# EAGLE design Mainboard (EAGLE 8.4.3)

## Sheet 1 of 3
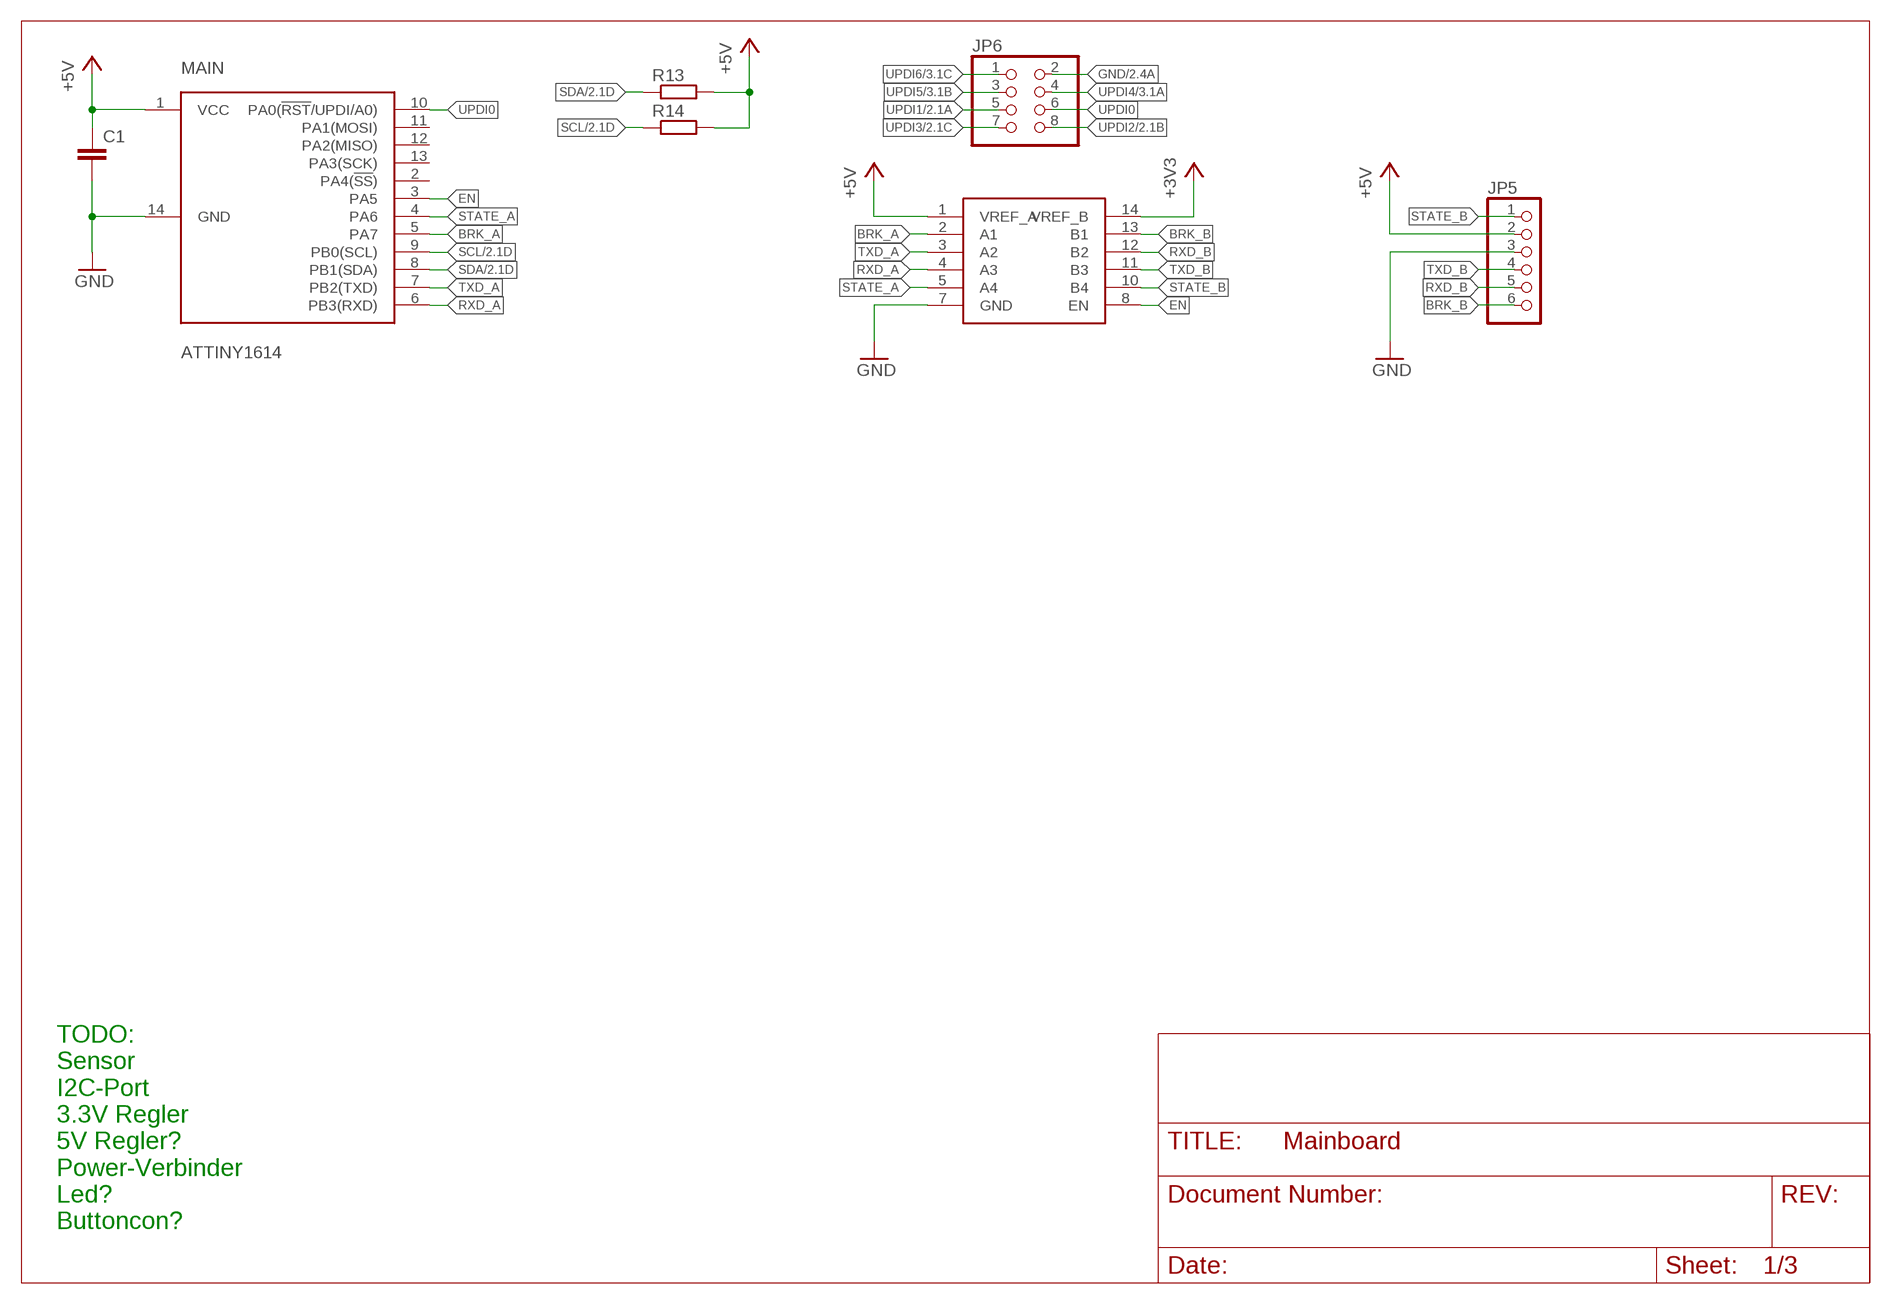
[diagram p0: schematic, sheet 1]

### Parts
C1  C-EUC0805  [C0805]
JP5  PINHD-1X6  [1X06]
JP6  PINHD-2X4  [2X04]
MAIN  ATTINY1614  ATTINY1614/16/17SSNR/SSFR  [SOIC14]
R13  R-EU_R0805  [R0805]
R14  R-EU_R0805  [R0805]
U$2  LSF0204  [TSSOP14]

### Nets
+3V3: U$2.14(VREF_B)
+5V: C1.1 JP5.2 MAIN.1(VCC) R13.2 R14.2 U$2.1(VREF_A) ; also sheet 2,3
BRK_A: MAIN.5(PA7) U$2.2(A1)
BRK_B: JP5.6 U$2.13(B1)
EN: MAIN.3(PA5) U$2.8(EN)
GND: C1.2 JP5.3 JP6.2 MAIN.14(GND) U$2.7(GND) ; also sheet 2,3
RXD_A: MAIN.6(PB3(RXD)) U$2.4(A3)
RXD_B: JP5.5 U$2.12(B2)
SCL: MAIN.9(PB0(SCL)) R14.1 ; also sheet 2,3
SDA: MAIN.8(PB1(SDA)) R13.1 ; also sheet 2,3
STATE_A: MAIN.4(PA6) U$2.5(A4)
STATE_B: JP5.1 U$2.10(B4)
TXD_A: MAIN.7(PB2(TXD)) U$2.3(A2)
TXD_B: JP5.4 U$2.11(B3)
UPDI0: JP6.6 MAIN.10(PA0(!RST!/UPDI/A0))
UPDI1: JP6.5 ; also sheet 2
UPDI2: JP6.8 ; also sheet 2
UPDI3: JP6.7 ; also sheet 2
UPDI4: JP6.4 ; also sheet 3
UPDI5: JP6.3 ; also sheet 3
UPDI6: JP6.1 ; also sheet 3
Unconnected: MAIN.2(PA4(!SS!)) MAIN.11(PA1(MOSI)) MAIN.12(PA2(MISO)) MAIN.13(PA3(SCK))

### Notes on the sheet
- TODO:
  Sensor
  I2C-Port
  3.3V Regler
  5V Regler?
  Power-Verbinder
  Led?
  Buttoncon?

## Sheet 2 of 3
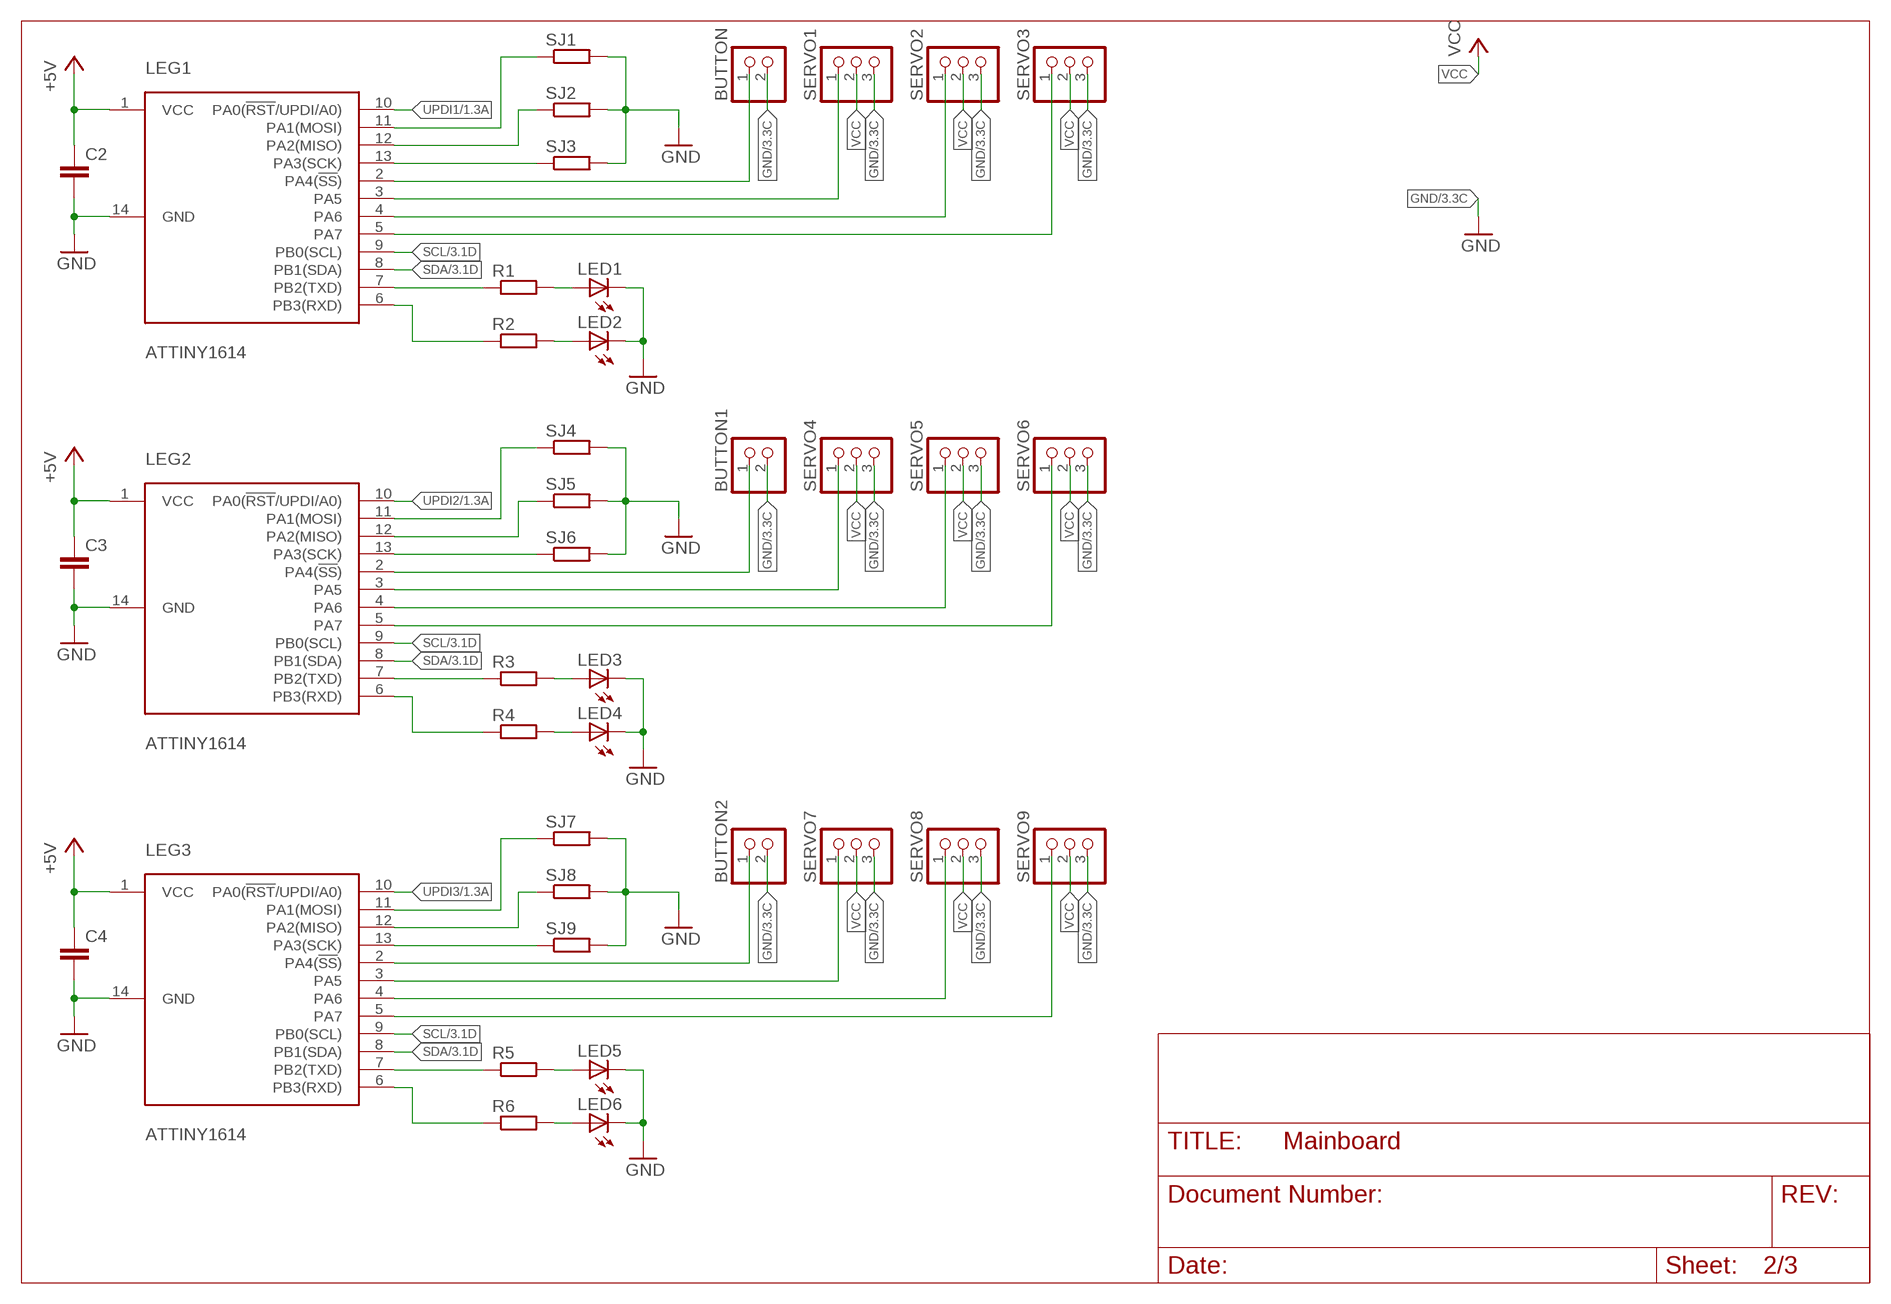
[diagram p1: schematic, sheet 2]

### Parts
BUTTON  PINHD-1X2  [1X02]
BUTTON1  PINHD-1X2  [1X02]
BUTTON2  PINHD-1X2  [1X02]
C2  C-EUC0805  [C0805]
C3  C-EUC0805  [C0805]
C4  C-EUC0805  [C0805]
LED1  LEDCHIP-LED0805  [CHIP-LED0805]
LED2  LEDCHIP-LED0805  [CHIP-LED0805]
LED3  LEDCHIP-LED0805  [CHIP-LED0805]
LED4  LEDCHIP-LED0805  [CHIP-LED0805]
LED5  LEDCHIP-LED0805  [CHIP-LED0805]
LED6  LEDCHIP-LED0805  [CHIP-LED0805]
LEG1  ATTINY1614  ATTINY1614/16/17SSNR/SSFR  [SOIC14]
LEG2  ATTINY1614  ATTINY1614/16/17SSNR/SSFR  [SOIC14]
LEG3  ATTINY1614  ATTINY1614/16/17SSNR/SSFR  [SOIC14]
R1  R-EU_R0805  [R0805]
R2  R-EU_R0805  [R0805]
R3  R-EU_R0805  [R0805]
R4  R-EU_R0805  [R0805]
R5  R-EU_R0805  [R0805]
R6  R-EU_R0805  [R0805]
SERVO1  PINHD-1X3  [1X03]
SERVO2  PINHD-1X3  [1X03]
SERVO3  PINHD-1X3  [1X03]
SERVO4  PINHD-1X3  [1X03]
SERVO5  PINHD-1X3  [1X03]
SERVO6  PINHD-1X3  [1X03]
SERVO7  PINHD-1X3  [1X03]
SERVO8  PINHD-1X3  [1X03]
SERVO9  PINHD-1X3  [1X03]
SJ1  R-EU_R0402  [R0402]
SJ2  R-EU_R0402  [R0402]
SJ3  R-EU_R0402  [R0402]
SJ4  R-EU_R0402  [R0402]
SJ5  R-EU_R0402  [R0402]
SJ6  R-EU_R0402  [R0402]
SJ7  R-EU_R0402  [R0402]
SJ8  R-EU_R0402  [R0402]
SJ9  R-EU_R0402  [R0402]

### Nets
+5V: C2.1 C3.1 C4.1 LEG1.1(VCC) LEG2.1(VCC) LEG3.1(VCC) ; also sheet 1,3
GND: BUTTON1.2 BUTTON2.2 BUTTON.2 C2.2 C3.2 C4.2 LED1.C LED2.C LED3.C LED4.C LED5.C LED6.C LEG1.14(GND) LEG2.14(GND) LEG3.14(GND) SERVO1.3 SERVO2.3 SERVO3.3 SERVO4.3 SERVO5.3 SERVO6.3 SERVO7.3 SERVO8.3 SERVO9.3 SJ1.2 SJ2.2 SJ3.2 SJ4.2 SJ5.2 SJ6.2 SJ7.2 SJ8.2 SJ9.2 ; also sheet 1,3
N$1: LEG1.7(PB2(TXD)) R1.1
N$2: LEG1.6(PB3(RXD)) R2.1
N$3: LEG1.11(PA1(MOSI)) SJ1.1
N$4: LEG1.12(PA2(MISO)) SJ2.1
N$5: LEG1.13(PA3(SCK)) SJ3.1
N$6: LED1.A R1.2
N$7: LED2.A R2.2
N$8: BUTTON.1 LEG1.2(PA4(!SS!))
N$9: LEG1.3(PA5) SERVO1.1
N$10: LEG1.4(PA6) SERVO2.1
N$11: LED3.A R3.2
N$12: LEG1.5(PA7) SERVO3.1
N$13: LED4.A R4.2
N$14: LEG2.7(PB2(TXD)) R3.1
N$15: LEG2.6(PB3(RXD)) R4.1
N$22: LEG2.11(PA1(MOSI)) SJ4.1
N$23: LEG2.12(PA2(MISO)) SJ5.1
N$24: LEG2.13(PA3(SCK)) SJ6.1
N$25: BUTTON1.1 LEG2.2(PA4(!SS!))
N$26: LEG2.3(PA5) SERVO4.1
N$27: LEG2.4(PA6) SERVO5.1
N$28: LEG2.5(PA7) SERVO6.1
N$29: LED5.A R5.2
N$30: LED6.A R6.2
N$31: LEG3.7(PB2(TXD)) R5.1
N$32: LEG3.6(PB3(RXD)) R6.1
N$33: LEG3.11(PA1(MOSI)) SJ7.1
N$34: LEG3.12(PA2(MISO)) SJ8.1
N$35: LEG3.13(PA3(SCK)) SJ9.1
N$36: BUTTON2.1 LEG3.2(PA4(!SS!))
N$37: LEG3.3(PA5) SERVO7.1
N$38: LEG3.4(PA6) SERVO8.1
N$39: LEG3.5(PA7) SERVO9.1
SCL: LEG1.9(PB0(SCL)) LEG2.9(PB0(SCL)) LEG3.9(PB0(SCL)) ; also sheet 1,3
SDA: LEG1.8(PB1(SDA)) LEG2.8(PB1(SDA)) LEG3.8(PB1(SDA)) ; also sheet 1,3
UPDI1: LEG1.10(PA0(!RST!/UPDI/A0)) ; also sheet 1
UPDI2: LEG2.10(PA0(!RST!/UPDI/A0)) ; also sheet 1
UPDI3: LEG3.10(PA0(!RST!/UPDI/A0)) ; also sheet 1
VCC: SERVO1.2 SERVO2.2 SERVO3.2 SERVO4.2 SERVO5.2 SERVO6.2 SERVO7.2 SERVO8.2 SERVO9.2

## Sheet 3 of 3
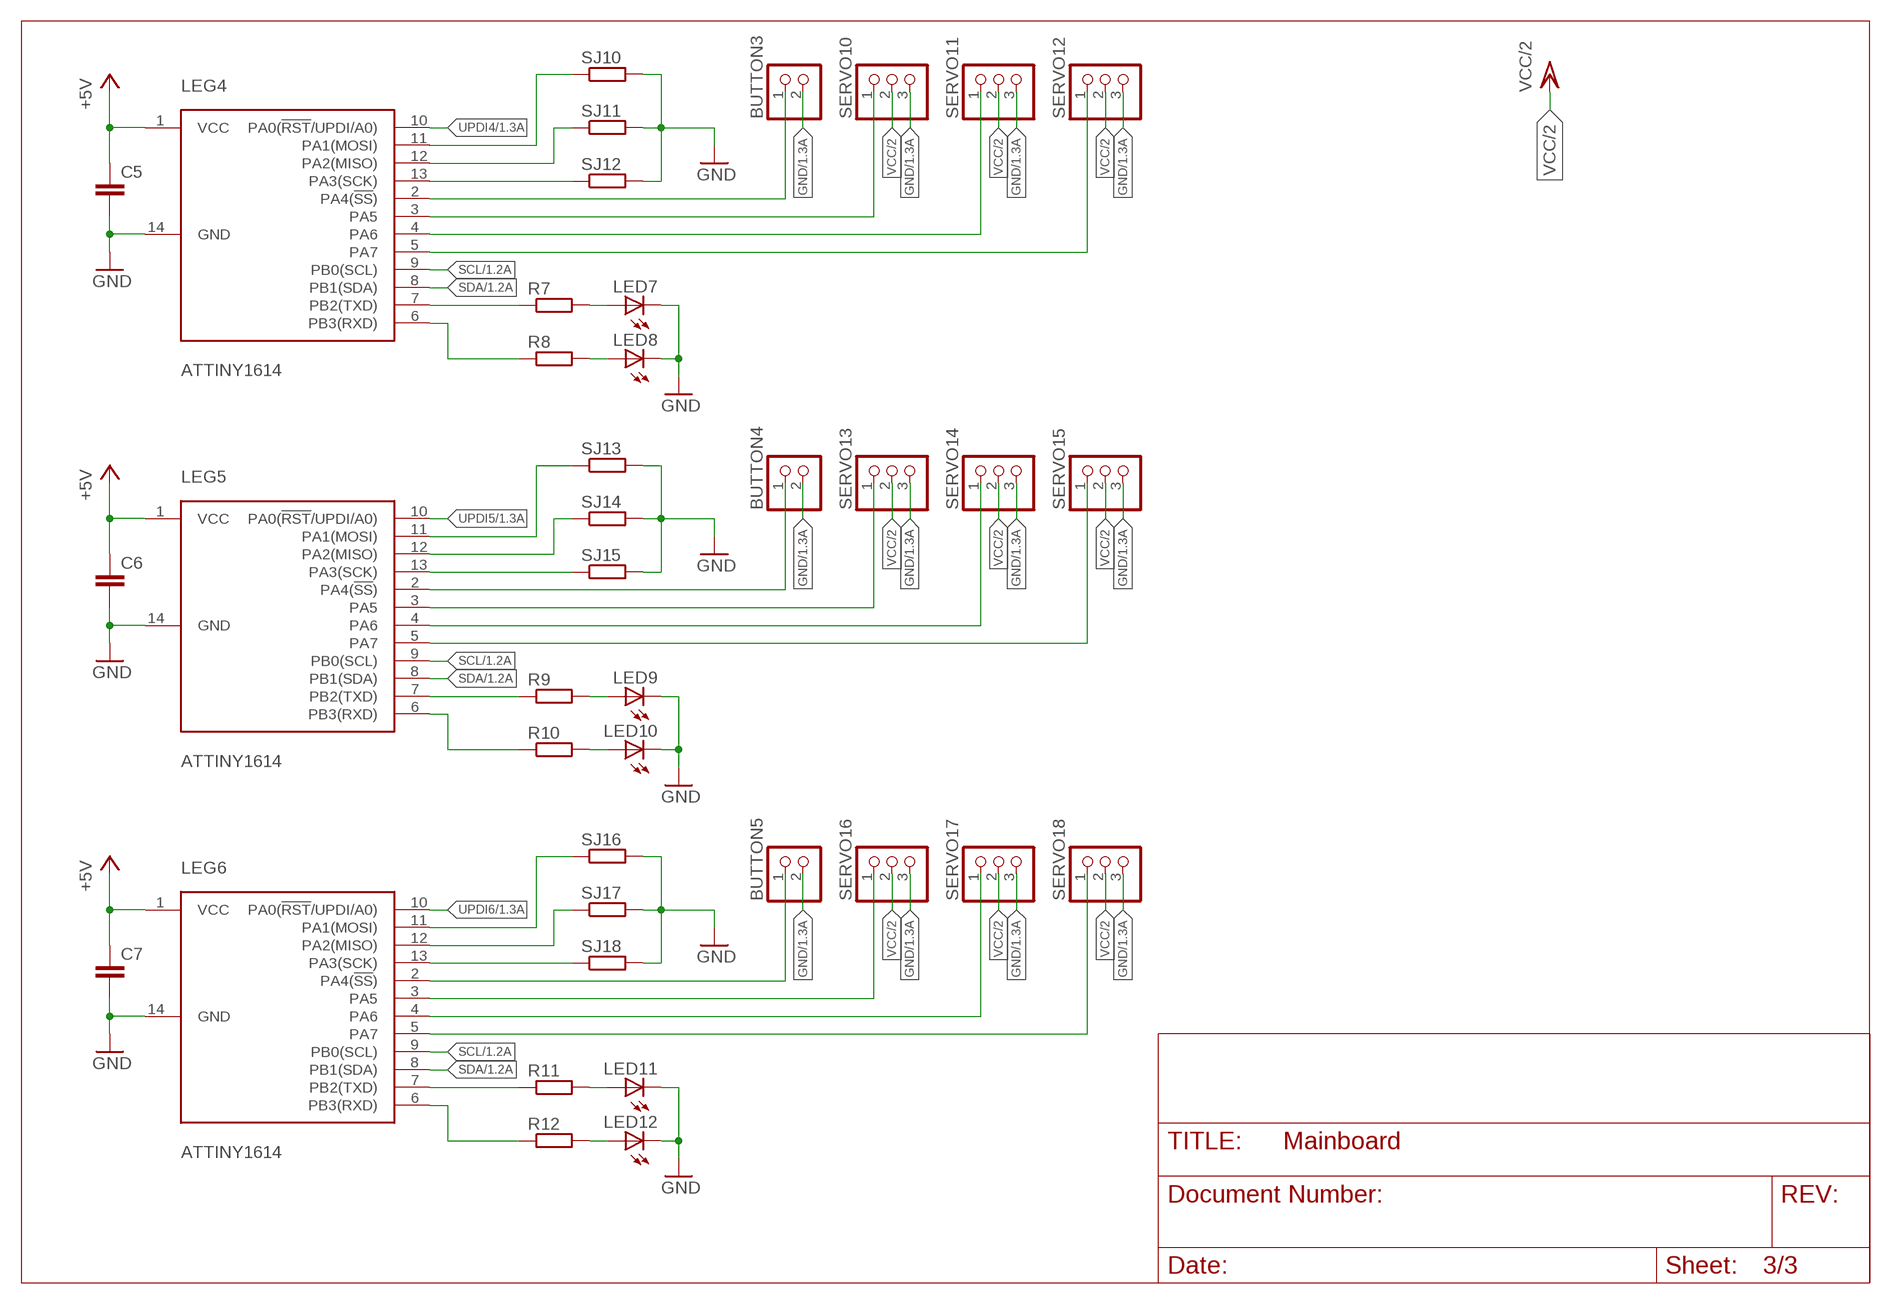
[diagram p2: schematic, sheet 3]

### Parts
BUTTON3  PINHD-1X2  [1X02]
BUTTON4  PINHD-1X2  [1X02]
BUTTON5  PINHD-1X2  [1X02]
C5  C-EUC0805  [C0805]
C6  C-EUC0805  [C0805]
C7  C-EUC0805  [C0805]
LED7  LEDCHIP-LED0805  [CHIP-LED0805]
LED8  LEDCHIP-LED0805  [CHIP-LED0805]
LED9  LEDCHIP-LED0805  [CHIP-LED0805]
LED10  LEDCHIP-LED0805  [CHIP-LED0805]
LED11  LEDCHIP-LED0805  [CHIP-LED0805]
LED12  LEDCHIP-LED0805  [CHIP-LED0805]
LEG4  ATTINY1614  ATTINY1614/16/17SSNR/SSFR  [SOIC14]
LEG5  ATTINY1614  ATTINY1614/16/17SSNR/SSFR  [SOIC14]
LEG6  ATTINY1614  ATTINY1614/16/17SSNR/SSFR  [SOIC14]
R7  R-EU_R0805  [R0805]
R8  R-EU_R0805  [R0805]
R9  R-EU_R0805  [R0805]
R10  R-EU_R0805  [R0805]
R11  R-EU_R0805  [R0805]
R12  R-EU_R0805  [R0805]
SERVO10  PINHD-1X3  [1X03]
SERVO11  PINHD-1X3  [1X03]
SERVO12  PINHD-1X3  [1X03]
SERVO13  PINHD-1X3  [1X03]
SERVO14  PINHD-1X3  [1X03]
SERVO15  PINHD-1X3  [1X03]
SERVO16  PINHD-1X3  [1X03]
SERVO17  PINHD-1X3  [1X03]
SERVO18  PINHD-1X3  [1X03]
SJ10  R-EU_R0402  [R0402]
SJ11  R-EU_R0402  [R0402]
SJ12  R-EU_R0402  [R0402]
SJ13  R-EU_R0402  [R0402]
SJ14  R-EU_R0402  [R0402]
SJ15  R-EU_R0402  [R0402]
SJ16  R-EU_R0402  [R0402]
SJ17  R-EU_R0402  [R0402]
SJ18  R-EU_R0402  [R0402]

### Nets
+5V: C5.1 C6.1 C7.1 LEG4.1(VCC) LEG5.1(VCC) LEG6.1(VCC) ; also sheet 1,2
GND: BUTTON3.2 BUTTON4.2 BUTTON5.2 C5.2 C6.2 C7.2 LED7.C LED8.C LED9.C LED10.C LED11.C LED12.C LEG4.14(GND) LEG5.14(GND) LEG6.14(GND) SERVO10.3 SERVO11.3 SERVO12.3 SERVO13.3 SERVO14.3 SERVO15.3 SERVO16.3 SERVO17.3 SERVO18.3 SJ10.2 SJ11.2 SJ12.2 SJ13.2 SJ14.2 SJ15.2 SJ16.2 SJ17.2 SJ18.2 ; also sheet 1,2
N$40: LED7.A R7.2
N$41: LED8.A R8.2
N$42: LEG4.7(PB2(TXD)) R7.1
N$43: LEG4.6(PB3(RXD)) R8.1
N$44: LEG4.11(PA1(MOSI)) SJ10.1
N$45: LEG4.12(PA2(MISO)) SJ11.1
N$46: LEG4.13(PA3(SCK)) SJ12.1
N$47: BUTTON3.1 LEG4.2(PA4(!SS!))
N$48: LEG4.3(PA5) SERVO10.1
N$49: LEG4.4(PA6) SERVO11.1
N$50: LEG4.5(PA7) SERVO12.1
N$51: LED9.A R9.2
N$52: LED10.A R10.2
N$53: LEG5.7(PB2(TXD)) R9.1
N$54: LEG5.6(PB3(RXD)) R10.1
N$55: LEG5.11(PA1(MOSI)) SJ13.1
N$56: LEG5.12(PA2(MISO)) SJ14.1
N$57: LEG5.13(PA3(SCK)) SJ15.1
N$58: BUTTON4.1 LEG5.2(PA4(!SS!))
N$59: LEG5.3(PA5) SERVO13.1
N$60: LEG5.4(PA6) SERVO14.1
N$61: LEG5.5(PA7) SERVO15.1
N$62: LED11.A R11.2
N$63: LED12.A R12.2
N$64: LEG6.7(PB2(TXD)) R11.1
N$65: LEG6.6(PB3(RXD)) R12.1
N$66: LEG6.11(PA1(MOSI)) SJ16.1
N$67: LEG6.12(PA2(MISO)) SJ17.1
N$68: LEG6.13(PA3(SCK)) SJ18.1
N$69: BUTTON5.1 LEG6.2(PA4(!SS!))
N$70: LEG6.3(PA5) SERVO16.1
N$71: LEG6.4(PA6) SERVO17.1
N$72: LEG6.5(PA7) SERVO18.1
SCL: LEG4.9(PB0(SCL)) LEG5.9(PB0(SCL)) LEG6.9(PB0(SCL)) ; also sheet 1,2
SDA: LEG4.8(PB1(SDA)) LEG5.8(PB1(SDA)) LEG6.8(PB1(SDA)) ; also sheet 1,2
UPDI4: LEG4.10(PA0(!RST!/UPDI/A0)) ; also sheet 1
UPDI5: LEG5.10(PA0(!RST!/UPDI/A0)) ; also sheet 1
UPDI6: LEG6.10(PA0(!RST!/UPDI/A0)) ; also sheet 1
VCC/2: SERVO10.2 SERVO11.2 SERVO12.2 SERVO13.2 SERVO14.2 SERVO15.2 SERVO16.2 SERVO17.2 SERVO18.2

## Library data of the parts
BUTTON BUTTON1-BUTTON5 = pinhead:PINHD-1X2: PIN HEADER
C1-C7 = rcl:C-EU: CAPACITOR, European symbol
JP5 = pinhead:PINHD-1X6: PIN HEADER
JP6 = pinhead:PINHD-2X4: PIN HEADER
LED1-LED12 = led:LED: LED OSRAM: - CHIPLED LG R971, LG N971, LY N971, LG Q971, LY Q971, LO R971, LY R971 LH N974, LH R974 LS Q976, LO Q976, LY Q976 LO Q996 - Hyper CHIPLED LW Q18S LB Q993, LB Q99A, LB R99A - SideLED LS A670, LO A670, LY A670, LG A670, LP A670 LB A673, LV A673, LT A673, LW A673 LH A674 LY A675 LS A676, LA A676, LO A676, LY A676, LW A676 LS A679, LY A679, LG A679 - Hyper Micro SIDELED® LS Y876, LA Y876, LO Y876, LY Y876 LT Y87S - SmartLED LW L88C, LW L88S LB L89C, LB L89S, LG L890 LS L89K, LO L89K, LY L89K LS L896, LA L896, LO L896, LY L896 - TOPLED LS T670, LO T670, LY T670, LG T670, LP T670 LSG T670, LSP T670, LSY T670, LOP T670, LYG T670 LG T671, LOG T671, LSG T671 LB T673, LV T673, LT T673, LW T673 LH T674 LS T676, LA T676, LO T676, LY T676, LB T676, LH T676, LSB T676, LW T676 LB T67C, LV T67C, LT T67C, LS T67K, LO T67K, LY T67K, LW E67C LS E67B, LA E67B, LO E67B, LY E67B, LB E67C, LV E67C, LT E67C LW T67C LS T679, LY T679, LG T679 LS T770, LO T770, LY T770, LG T770, LP T770 LB T773, LV T773, LT T773, LW T773 LH T774 LS E675, LA E675, LY E675, LS T675 LS T776, LA T776, LO T776, LY T776, LB T776 LHGB T686 LT T68C, LB T68C - Hyper Mini TOPLED® LB M676 - Mini TOPLED Santana® LG M470 LS M47K, LO M47K, LY M47K Source: http://www.osram.convergy.de LUXEON: - LUMILED® LXK2-PW12-R00, LXK2-PW12-S00, LXK2-PW14-U00, LXK2-PW14-V00 LXK2-PM12-R00, LXK2-PM12-S00, LXK2-PM14-U00 LXK2-PE12-Q00, LXK2-PE12-R00, LXK2-PE12-S00, LXK2-PE14-T00, LXK2-PE14-U00 LXK2-PB12-K00, LXK2-PB12-L00, LXK2-PB12-M00, LXK2-PB14-N00, LXK2-PB14-P00, LXK2-PB14-Q00 LXK2-PR12-L00, LXK2-PR12-M00, LXK2-PR14-Q00, LXK2-PR14-R00 LXK2-PD12-Q00, LXK2-PD12-R00, LXK2-PD12-S00 LXK2-PH12-R00, LXK2-PH12-S00 LXK2-PL12-P00, LXK2-PL12-Q00, LXK2-PL12-R00 Source: www.luxeon.com KINGBRIGHT: KA-3528ASYC Source: www.kingbright.com
LEG1-LEG6 MAIN = ATTINY1614:ATTINY1614/16/17
R1-R14 SJ1-SJ18 = rcl:R-EU_: RESISTOR, European symbol
SERVO1-SERVO18 = pinhead:PINHD-1X3: PIN HEADER
U$2 = LSF0204:LSF0204

## Board
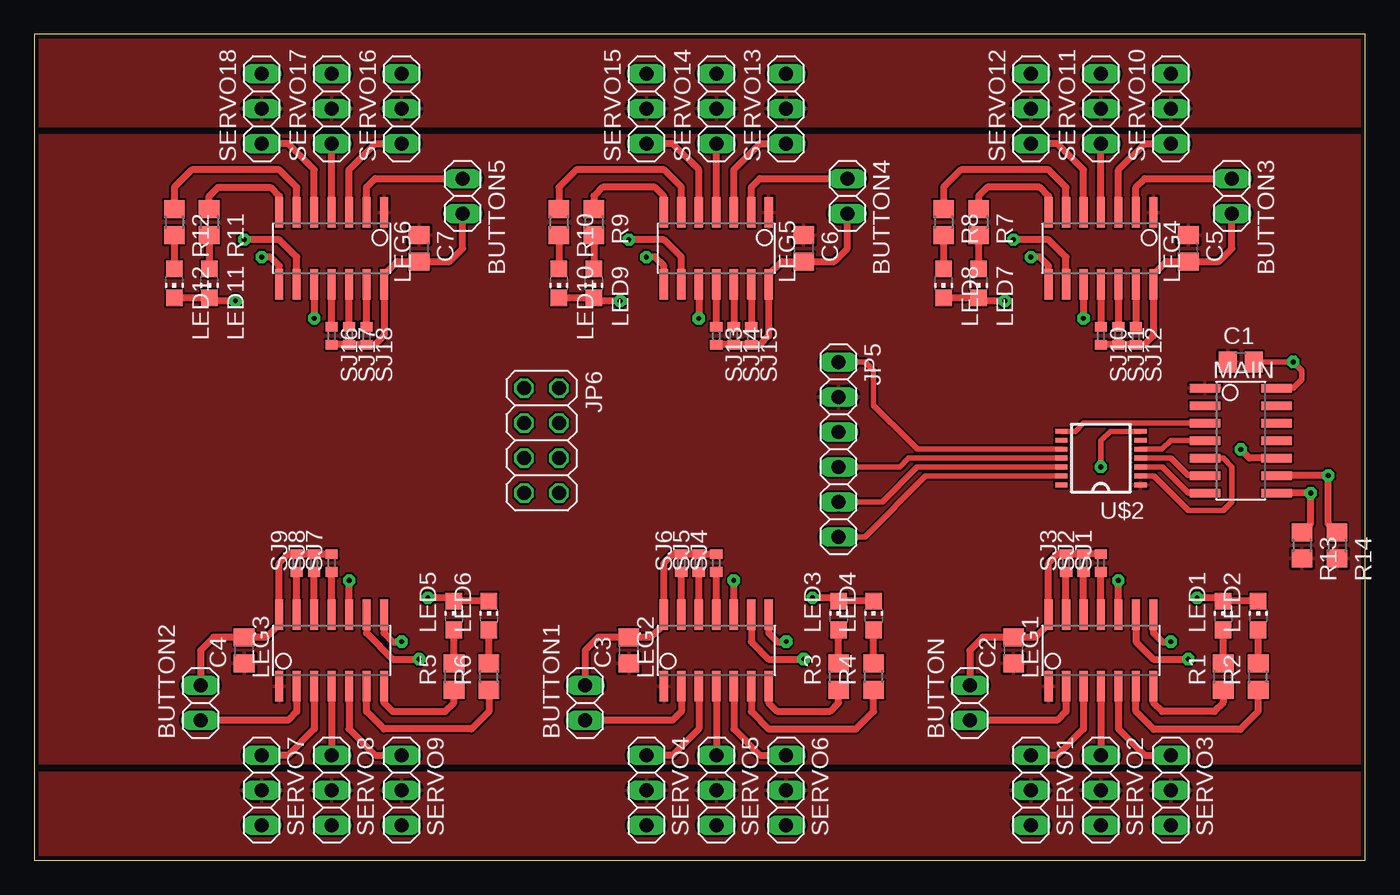
[diagram p3: board, top side]
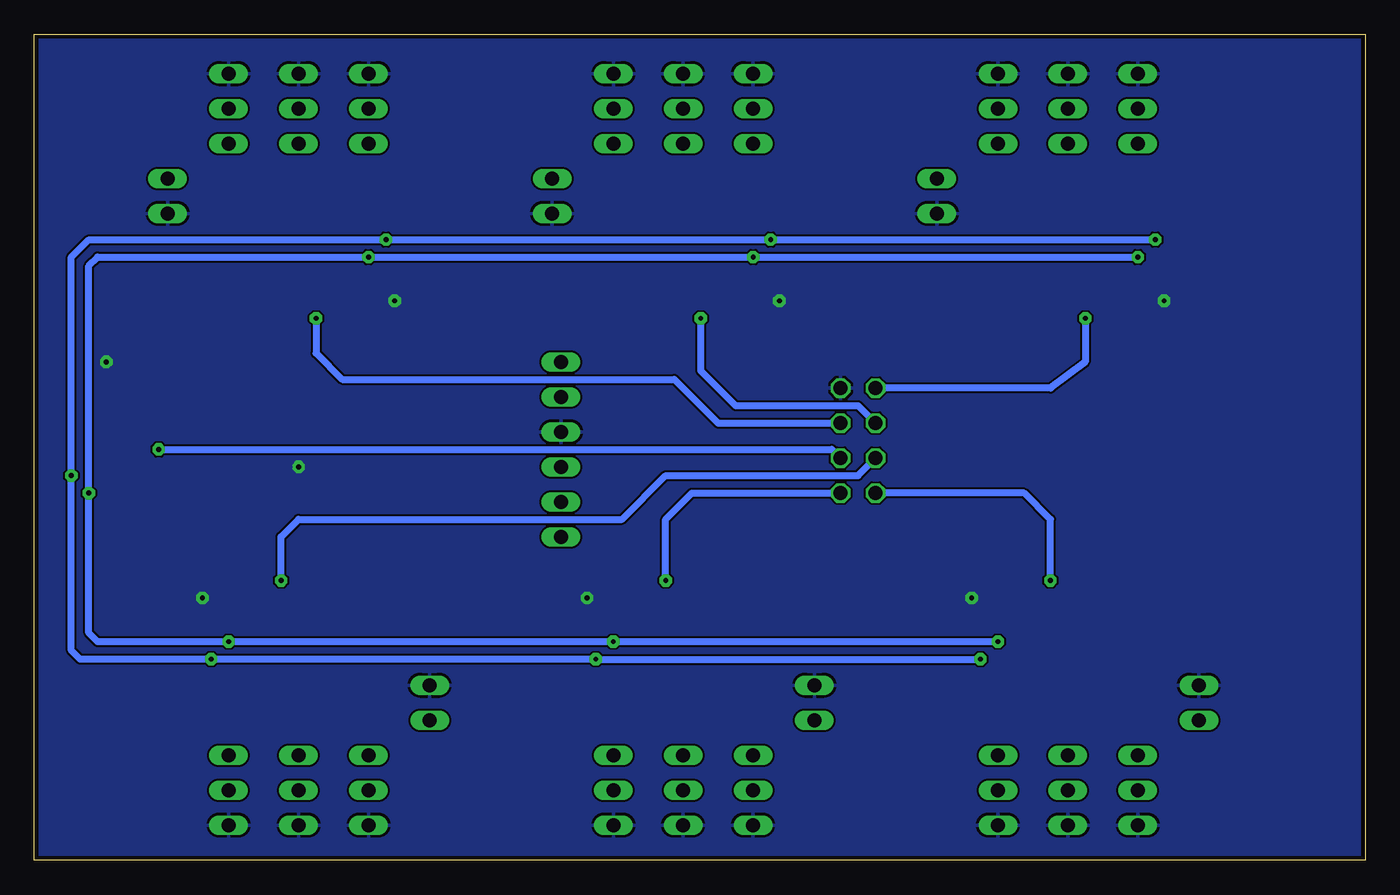
[diagram p4: board, bottom side, seen from below]

Size 96.66 x 59.99 mm. Coordinates in mm from the lower left corner, seen from the top.
Outline: 0,0 96.66,0 96.66,59.99 0,59.99 0,0
Copper layers (1*16): Top 0.035mm / dielectric 1.5mm / Bottom 0.035mm
Design rules "PCB-POOL Standard": minimum track width 0.15mm, minimum drill 0.3mm, track to track 0.15mm, track to pad 0.15mm, pad to pad 0.15mm, via to via 0.15mm, smd to smd 0.15mm, copper to edge 0.3mm, drill to drill 0.2mm, minimum pad ring 0.2mm, minimum via ring 0.15mm, stop-mask expansion 0.075mm, vias tented up to drill 0mil, thermal gap 0.2mm

### Footprints (pad centres in the part's own frame; a part is rotated, then mirrored left to right if it is on the bottom)
1X02 = drill 1.016 long: 1 -1.27,0; 2 1.27,0
C0805 = smd 1.3 x 1.5: 1 -0.95,0; 2 0.95,0
1X06 = drill 1.016 long: 1 -6.35,0; 2 -3.81,0; 3 -1.27,0; 4 1.27,0; 5 3.81,0; 6 6.35,0
2X04 = drill 1.016 octagon: 1 -3.81,-1.27; 2 -3.81,1.27; 3 -1.27,-1.27; 4 -1.27,1.27; 5 1.27,-1.27; 6 1.27,1.27; 7 3.81,-1.27; 8 3.81,1.27
CHIP-LED0805 = smd 1.2 x 1.2: A 0,-1.05; C 0,1.05
SOIC14 = smd 0.61 x 2.21: 1 -3.81,-2.603; 2 -2.54,-2.603; 3 -1.27,-2.603; 4 0,-2.603; 5 1.27,-2.603; 6 2.54,-2.603; 7 3.81,-2.603; 8 3.81,2.603; 9 2.54,2.603; 10 1.27,2.603; 11 0,2.603; 12 -1.27,2.603; 13 -2.54,2.603; 14 -3.81,2.603
R0805 = smd 1.3 x 1.5: 1 -0.95,0; 2 0.95,0
1X03 = drill 1.016 long: 1 -2.54,0; 2 0,0; 3 2.54,0
R0402 = smd 0.7 x 0.9: 1 -0.65,0; 2 0.65,0
TSSOP14 = smd 0.9 x 0.35: 1 -2.875,1.95; 2 -2.875,1.3; 3 -2.875,0.65; 4 -2.875,0; 5 -2.875,-0.65; 6 -2.875,-1.3; 7 -2.875,-1.95; 8 2.875,-1.95; 9 2.875,-1.3; 10 2.875,-0.65; 11 2.875,0; 12 2.875,0.65; 13 2.875,1.3; 14 2.875,1.95

### Placement (x,y rotation side)
BUTTON  67.94,11.43 90 top
BUTTON1  40.01,11.43 90 top
BUTTON2  12.06,11.43 90 top
BUTTON3  87,48.26 270 top
BUTTON4  59.05,48.26 270 top
BUTTON5  31.11,48.26 270 top
C1  87.63,36.2 0 top
C2  71.12,15.24 90 top
C3  43.18,15.24 90 top
C4  15.24,15.24 90 top
C5  83.82,44.45 270 top
C6  55.88,44.45 270 top
C7  27.94,44.45 270 top
JP5  58.42,29.84 270 top
JP6  36.83,30.48 270 top
LED1  86.36,17.78 0 top
LED2  88.9,17.78 0 top
LED3  58.42,17.78 0 top
LED4  60.96,17.78 0 top
LED5  30.48,17.78 0 top
LED6  33.02,17.78 0 top
LED7  68.58,41.91 180 top
LED8  66.04,41.91 180 top
LED9  40.64,41.91 180 top
LED10  38.1,41.91 180 top
LED11  12.7,41.91 180 top
LED12  10.16,41.91 180 top
LEG1  77.47,15.24 0 top
LEG2  49.53,15.24 0 top
LEG3  21.59,15.24 0 top
LEG4  77.47,44.45 180 top
LEG5  49.53,44.45 180 top
LEG6  21.59,44.45 180 top
MAIN  87.63,30.48 270 top
R1  86.36,13.34 90 top
R2  88.9,13.34 90 top
R3  58.42,13.34 90 top
R4  60.96,13.34 90 top
R5  30.48,13.34 90 top
R6  33.02,13.34 90 top
R7  68.58,46.35 270 top
R8  66.04,46.35 270 top
R9  40.64,46.35 270 top
R10  38.1,46.35 270 top
R11  12.7,46.35 270 top
R12  10.16,46.35 270 top
R13  92.08,22.86 270 top
R14  94.61,22.86 270 top
SERVO1  72.39,5.08 270 top
SERVO2  77.47,5.08 270 top
SERVO3  82.55,5.08 270 top
SERVO4  44.45,5.08 270 top
SERVO5  49.53,5.08 270 top
SERVO6  54.61,5.08 270 top
SERVO7  16.51,5.08 270 top
SERVO8  21.59,5.08 270 top
SERVO9  26.67,5.08 270 top
SERVO10  82.55,54.61 90 top
SERVO11  77.47,54.61 90 top
SERVO12  72.39,54.61 90 top
SERVO13  54.61,54.61 90 top
SERVO14  49.53,54.61 90 top
SERVO15  44.45,54.61 90 top
SERVO16  26.67,54.61 90 top
SERVO17  21.59,54.61 90 top
SERVO18  16.51,54.61 90 top
SJ1  77.47,21.59 90 top
SJ2  76.2,21.59 90 top
SJ3  74.93,21.59 90 top
SJ4  49.53,21.59 90 top
SJ5  48.26,21.59 90 top
SJ6  46.99,21.59 90 top
SJ7  21.59,21.59 90 top
SJ8  20.32,21.59 90 top
SJ9  19.05,21.59 90 top
SJ10  77.47,38.1 270 top
SJ11  78.74,38.1 270 top
SJ12  80.01,38.1 270 top
SJ13  49.53,38.1 270 top
SJ14  50.8,38.1 270 top
SJ15  52.07,38.1 270 top
SJ16  21.59,38.1 270 top
SJ17  22.86,38.1 270 top
SJ18  24.13,38.1 270 top
U$2  77.47,29.21 180 top

### Tracks (layer width: path | path; a pad name or v marks a point on that pad's centre or on a via)
+5V
  pour Top: -1.27,52.7 97.16,52.7 97.16,6.99 -1.27,6.99
BRK_A
  Top 0.406: MAIN.5 86.36,29.21 87,28.57 87,26.04 86.36,25.4 83.82,25.4 81.31,27.91 U$2.2
BRK_B
  Top 0.406: JP5.6 60.33,23.5 64.74,27.91 U$2.13
EN
  Top 0.406: U$2.8 75.61,31.16 76.2,31.75 MAIN.3
GND  (via drill 0.35 pad 0.9)
  Top 0.406: U$2.7 78.15,31.16 77.47,30.48 v77.47,28.57 | MAIN.14 91.44,34.29 92.08,34.92 92.08,35.56 v91.44,36.2 C1.2
  Top 0.508: BUTTON5.2 31.11,44.45 30.16,43.5 C7.2 26.36,43.5 25.4,42.55 LEG6.14 25.4,38.1 24.75,37.45 SJ18.2 SJ17.2 SJ16.2 | BUTTON4.2 59.05,44.45 58.1,43.5 C6.2 54.3,43.5 53.34,42.55 LEG5.14 53.34,38.1 52.69,37.45 SJ15.2 SJ14.2 SJ13.2 | BUTTON3.2 87,44.45 86.05,43.5 C5.2 82.23,43.5 81.28,42.55 LEG4.14 81.28,38.1 80.63,37.45 SJ12.2 SJ11.2 SJ10.2 | BUTTON.2 67.94,15.24 68.89,16.19 C2.2 72.7,16.19 73.66,17.14 LEG1.14 73.66,21.59 74.31,22.24 SJ3.2 SJ2.2 SJ1.2 77.48,22.23 | BUTTON1.2 40.01,15.24 40.95,16.19 C3.2 44.77,16.19 45.72,17.14 LEG2.14 45.72,21.59 46.37,22.24 SJ6.2 SJ5.2 SJ4.2 | BUTTON2.2 12.06,15.24 13.02,16.19 C4.2 16.82,16.19 17.78,17.14 LEG3.14 17.78,21.59 18.43,22.24 SJ9.2 SJ8.2 SJ7.2 | LED2.C LED1.C 86.14,19.05 v84.45,19.05 | LED8.C LED7.C 68.8,40.64 v70.48,40.64 | LED4.C LED3.C 58.2,19.05 v56.52,19.05 | LED6.C LED5.C 30.26,19.05 v28.57,19.05 | LED12.C LED11.C 12.92,40.64 v14.61,40.64 | LED10.C LED9.C 40.86,40.64 v42.55,40.64
  pour Bottom: -0.64,60.33 -0.64,-0.64 97.79,-0.64 97.79,60.33
N$1
  Top 0.508: R1.1 86.36,11.43 85.72,10.79 81.92,10.79 81.28,11.43 LEG1.7
N$2
  Top 0.508: LEG1.6 80.01,10.79 81.31,9.5 87.61,9.5 88.9,10.79 R2.1
N$3
  Top 0.508: LEG1.11 SJ1.1
N$4
  Top 0.508: LEG1.12 SJ2.1
N$5
  Top 0.508: LEG1.13 SJ3.1
N$6
  Top 0.508: R1.2 LED1.A
N$7
  Top 0.508: R2.2 LED2.A
N$8
  Top 0.508: LEG1.2 74.93,10.79 74.3,10.16 BUTTON.1
N$9
  Top 0.508: LEG1.3 76.2,9.53 74.3,7.62 SERVO1.1
N$10
  Top 0.508: LEG1.4 SERVO2.1
N$11
  Top 0.508: R3.2 LED3.A
N$12
  Top 0.508: LEG1.5 78.74,9.53 80.64,7.62 SERVO3.1
N$13
  Top 0.508: R4.2 LED4.A
N$14
  Top 0.508: LEG2.7 53.34,11.43 53.95,10.82 57.81,10.82 58.42,11.43 R3.1
N$15
  Top 0.508: LEG2.6 52.07,10.79 53.34,9.53 59.69,9.53 60.96,10.79 R4.1
N$22
  Top 0.508: LEG2.11 SJ4.1
N$23
  Top 0.508: LEG2.12 SJ5.1
N$24
  Top 0.508: LEG2.13 SJ6.1
N$25
  Top 0.508: LEG2.2 46.99,10.79 46.35,10.16 BUTTON1.1
N$26
  Top 0.508: LEG2.3 48.26,9.53 46.35,7.62 SERVO4.1
N$27
  Top 0.508: LEG2.4 SERVO5.1
N$28
  Top 0.508: LEG2.5 50.8,9.53 52.7,7.62 SERVO6.1
N$29
  Top 0.508: R5.2 LED5.A
N$30
  Top 0.508: R6.2 LED6.A
N$31
  Top 0.508: LEG3.7 25.4,11.43 26.04,10.79 29.84,10.79 30.48,11.43 R5.1
N$32
  Top 0.508: R6.1 33.02,10.79 31.75,9.53 25.4,9.53 24.13,10.79 LEG3.6
N$33
  Top 0.508: LEG3.11 SJ7.1
N$34
  Top 0.508: LEG3.12 SJ8.1
N$35
  Top 0.508: LEG3.13 SJ9.1
N$36
  Top 0.508: LEG3.2 19.05,10.79 18.41,10.16 BUTTON2.1
N$37
  Top 0.508: LEG3.3 20.32,9.53 18.41,7.62 SERVO7.1
N$38
  Top 0.508: LEG3.4 SERVO8.1
N$39
  Top 0.508: LEG3.5 22.86,9.53 24.77,7.62 SERVO9.1
N$40
  Top 0.508: R7.2 LED7.A
N$41
  Top 0.508: R8.2 LED8.A
N$42
  Top 0.508: LEG4.7 73.66,48.26 73.03,48.9 69.22,48.9 68.58,48.26 R7.1
N$43
  Top 0.508: LEG4.6 74.93,48.9 73.66,50.16 67.31,50.16 66.04,48.9 R8.1
N$44
  Top 0.508: LEG4.11 SJ10.1
N$45
  Top 0.508: LEG4.12 SJ11.1
N$46
  Top 0.508: LEG4.13 SJ12.1
N$47
  Top 0.508: LEG4.2 80.01,48.9 80.64,49.53 BUTTON3.1
N$48
  Top 0.508: LEG4.3 78.74,50.16 80.64,52.07 SERVO10.1
N$49
  Top 0.508: LEG4.4 SERVO11.1
N$50
  Top 0.508: LEG4.5 76.2,50.16 74.3,52.07 SERVO12.1
N$51
  Top 0.508: R9.2 LED9.A
N$52
  Top 0.508: R10.2 LED10.A
N$53
  Top 0.508: LEG5.7 45.72,48.26 45.09,48.9 41.27,48.9 40.64,48.26 R9.1
N$54
  Top 0.508: LEG5.6 46.99,48.9 45.72,50.16 39.37,50.16 38.1,48.9 R10.1
N$55
  Top 0.508: SJ13.1 LEG5.11
N$56
  Top 0.508: LEG5.12 SJ14.1
N$57
  Top 0.508: LEG5.13 SJ15.1
N$58
  Top 0.508: LEG5.2 52.07,48.9 52.7,49.53 BUTTON4.1
N$59
  Top 0.508: LEG5.3 50.8,50.16 52.7,52.07 SERVO13.1
N$60
  Top 0.508: LEG5.4 SERVO14.1
N$61
  Top 0.508: LEG5.5 48.26,50.16 46.35,52.07 SERVO15.1
N$62
  Top 0.508: R11.2 LED11.A
N$63
  Top 0.508: R12.2 LED12.A
N$64
  Top 0.508: R11.1 12.7,48.26 13.34,48.9 17.14,48.9 17.78,48.26 LEG6.7
N$65
  Top 0.508: LEG6.6 19.05,48.9 17.78,50.16 11.43,50.16 10.16,48.9 R12.1
N$66
  Top 0.508: SJ16.1 LEG6.11
N$67
  Top 0.508: SJ17.1 LEG6.12
N$68
  Top 0.508: SJ18.1 LEG6.13
N$69
  Top 0.508: LEG6.2 24.13,48.9 24.77,49.53 BUTTON5.1
N$70
  Top 0.508: SERVO16.1 24.77,52.07 22.86,50.16 LEG6.3
N$71
  Top 0.508: LEG6.4 SERVO17.1
N$72
  Top 0.508: LEG6.5 20.32,50.16 18.41,52.07 SERVO18.1
RXD_A
  Top 0.406: MAIN.6 83.82,27.94 82.55,29.21 U$2.4
RXD_B
  Top 0.406: 64.14,28.56 U$2.12 | 64.14,28.56 64.12,28.56 | JP5.5 61.59,26.04 64.12,28.56 | 64.12,28.56 64.14,28.56
SCL  (via drill 0.35 pad 0.9)
  Top 0.508: LEG1.9 80.01,15.88 81.28,14.61 v83.82,14.61 | LEG2.9 52.07,15.88 53.34,14.61 v55.88,14.61 | LEG3.9 24.13,16.51 26.04,14.61 v27.94,14.61 | MAIN.9 v93.98,27.94 93.98,24.45 R14.1 | LEG4.9 74.93,43.81 73.66,45.09 v71.12,45.09 | LEG5.9 46.99,43.81 45.72,45.09 v43.18,45.09 | LEG6.9 19.05,43.81 17.78,45.09 v15.24,45.09
  Bottom 0.508: v27.94,14.61 v55.88,14.61 v83.82,14.61 93.34,14.61 93.98,15.24 v93.98,27.94 93.98,43.81 92.71,45.09 v71.12,45.09 v43.18,45.09 v15.24,45.09
SDA  (via drill 0.35 pad 0.9)
  Top 0.508: LEG1.8 81.28,16.51 81.92,15.88 v82.55,15.88 | LEG2.8 53.34,16.51 53.98,15.88 v54.61,15.88 | LEG3.8 25.4,16.51 26.04,15.88 v26.67,15.88 | MAIN.8 v92.71,26.67 92.71,24.45 R13.1 | LEG4.8 73.66,43.18 73.03,43.81 v72.39,43.81 | LEG5.8 45.72,43.18 45.09,43.81 v44.45,43.81 | LEG6.8 17.78,43.18 17.14,43.81 v16.51,43.81
  Bottom 0.508: v26.67,15.88 v54.61,15.88 v82.55,15.88 92.08,15.88 92.71,16.51 v92.71,26.67 92.71,43.18 92.08,43.81 v72.39,43.81 v44.45,43.81 v16.51,43.81
STATE_A
  Top 0.406: U$2.5 81.9,29.86 82.55,30.48 MAIN.4
STATE_B
  Top 0.406: 63.51,30.49 60.96,33.02 60.96,35.56 60.33,36.2 JP5.1 | 63.51,30.49 63.52,30.48 | U$2.10 64.14,29.86 63.51,30.49
TXD_A
  Top 0.406: MAIN.7 83.82,26.67 81.93,28.56 U$2.3
TXD_B
  Top 0.406: JP5.4 62.87,28.57 63.5,29.21 U$2.11
UPDI0  (via drill 0.35 pad 0.9)
  Top 0.508: MAIN.10 88.27,29.21 v87.63,29.84
  Bottom 0.508: v87.63,29.84 38.73,29.84 JP6.6
UPDI1  (via drill 0.35 pad 0.9)
  Top 0.508: LEG1.10 v78.74,20.32
  Bottom 0.508: v78.74,20.32 78.74,23.5 77.47,24.77 53.98,24.77 50.8,27.94 36.83,27.94 JP6.5
UPDI2  (via drill 0.35 pad 0.9)
  Top 0.508: LEG2.10 v50.8,20.32
  Bottom 0.508: v50.8,20.32 50.8,24.77 48.9,26.67 JP6.8
UPDI3  (via drill 0.35 pad 0.9)
  Top 0.508: LEG3.10 v22.86,20.32
  Bottom 0.508: JP6.7 24.77,26.67 22.86,24.77 v22.86,20.32
UPDI4  (via drill 0.35 pad 0.9)
  Top 0.508: LEG4.10 v76.2,39.37
  Bottom 0.508: v76.2,39.37 76.2,36.83 74.3,34.92 50.16,34.92 46.99,31.75 JP6.4
UPDI5  (via drill 0.35 pad 0.9)
  Top 0.508: LEG5.10 v48.26,39.37
  Bottom 0.508: v48.26,39.37 48.26,35.56 45.72,33.02 36.83,33.02 JP6.3
UPDI6  (via drill 0.35 pad 0.9)
  Top 0.508: LEG6.10 v20.32,39.37
  Bottom 0.508: v20.32,39.37 20.32,36.2 22.86,34.29 JP6.1
VCC
  pour Top: -1.27,-1.27 97.16,-1.27 97.16,6.35 -1.27,6.35
VCC/2
  pour Top: -1.27,60.96 -1.27,53.34 97.16,53.34 97.16,60.96